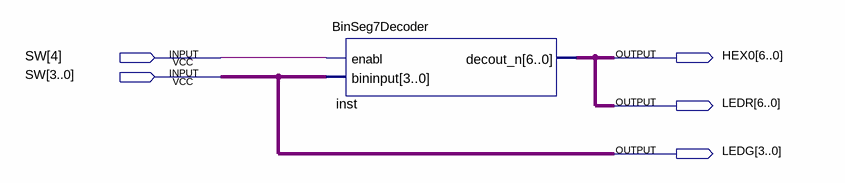
[diagram p0: schematic sheet]
// Quartus schematic DisplayDemo.bdf as structural Verilog: 1 symbols, 5 pins
module DisplayDemo (
  input  [4:0] SW,
  output [6:0] HEX0,
  output [6:0] LEDR,
  output [3:0] LEDG
);

  BinSeg7Decoder inst (.enabl(SW[4]), .bininput(SW[3:0]), .decout_n(HEX0));

  assign LEDG = SW[3:0];
  assign LEDR = HEX0;
endmodule
